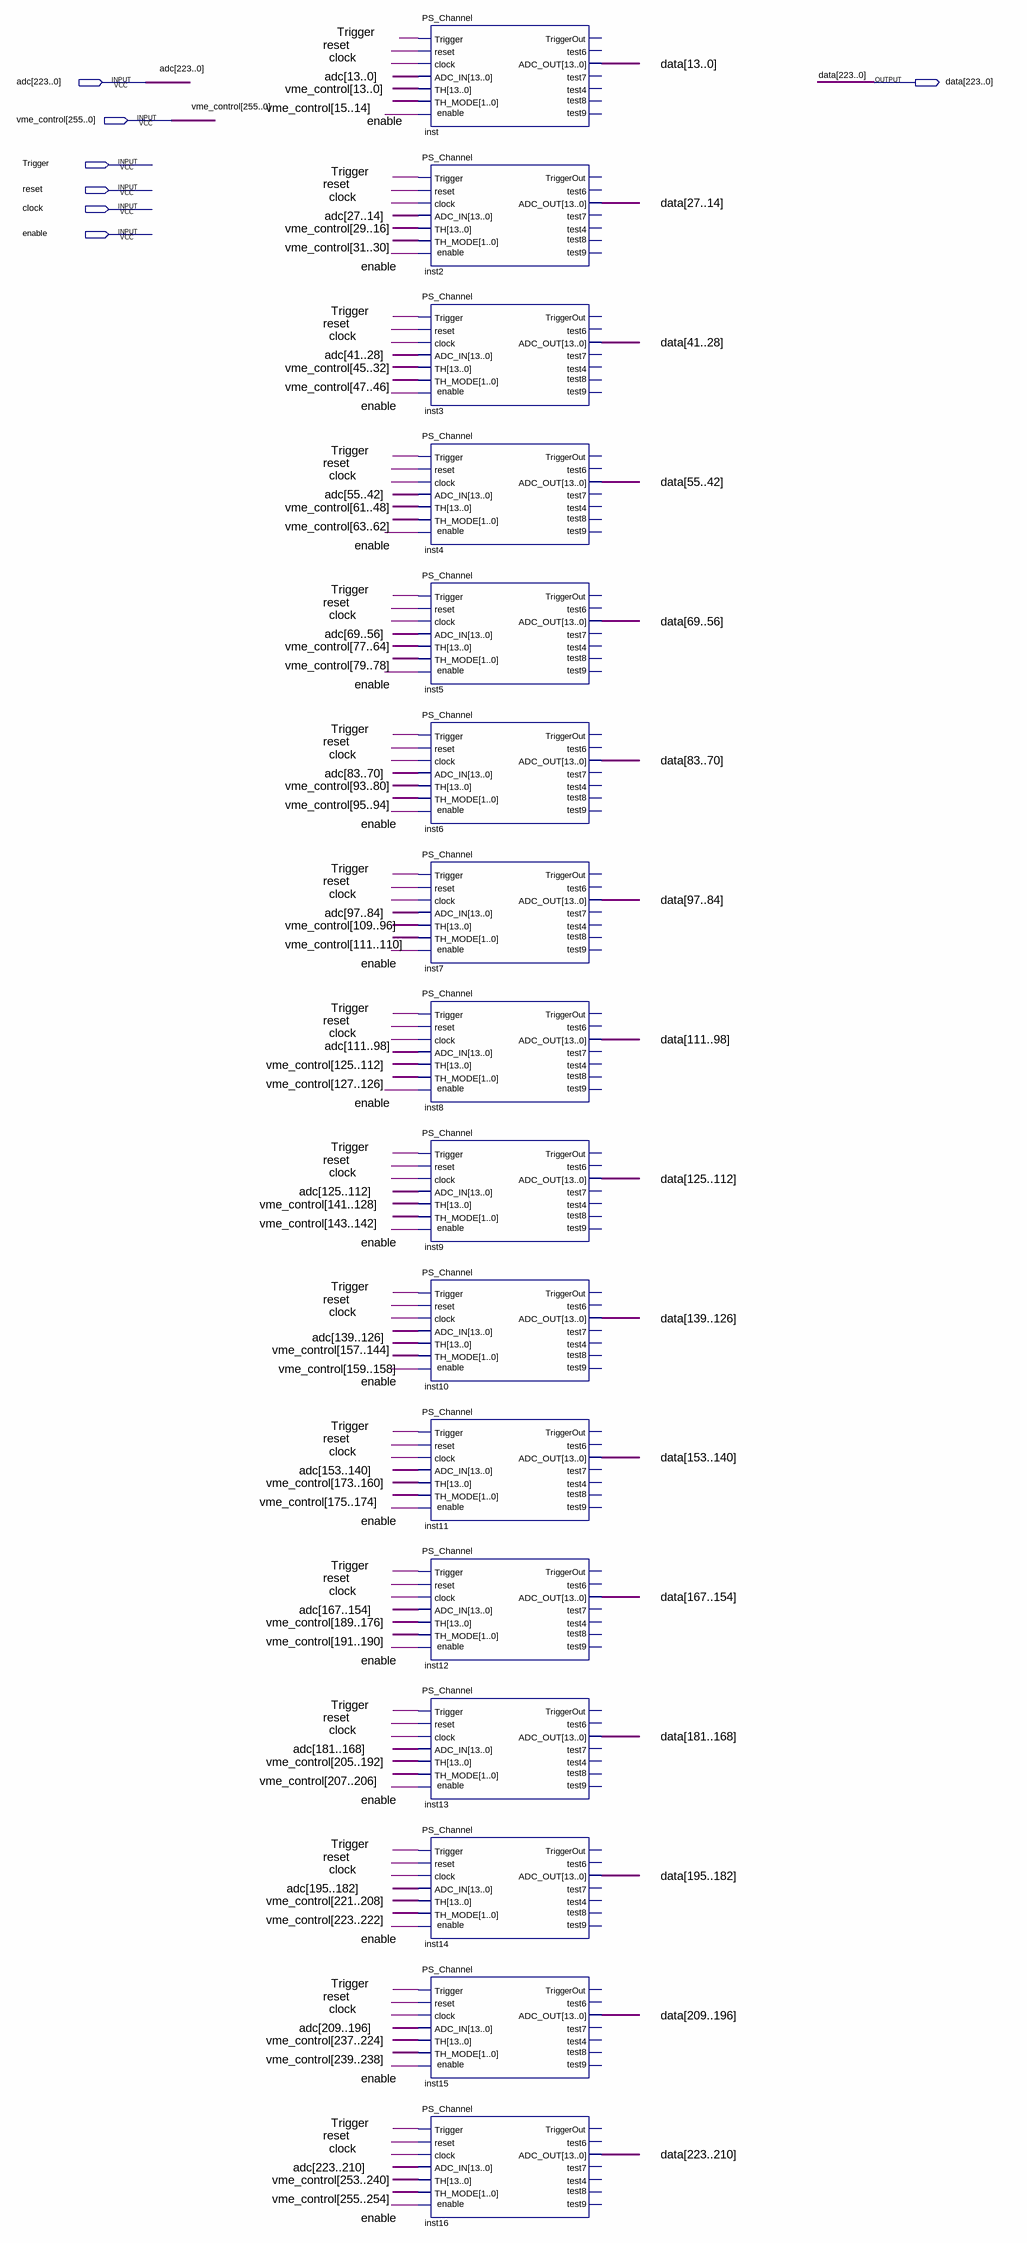
[diagram p0: schematic sheet]
// Quartus schematic PS_Block.bdf as structural Verilog: 16 symbols, 7 pins
module PS_Block (
  input  [223:0] adc,
  input  [255:0] vme_control,
  input  Trigger,
  input  reset,
  input  clock,
  input  enable,
  output [223:0] data
);

  PS_Channel inst (
    .Trigger(Trigger), .reset(reset), .clock(clock), .ADC_IN(adc[13:0]), .TH(vme_control[13:0]),
    .TH_MODE(vme_control[15:14]), .enable(enable), .ADC_OUT(data[13:0]));  // open: TriggerOut, test6, test7, test4, test8, test9
  PS_Channel inst2 (
    .Trigger(Trigger), .reset(reset), .clock(clock), .ADC_IN(adc[27:14]), .TH(vme_control[29:16]),
    .TH_MODE(vme_control[31:30]), .enable(enable), .ADC_OUT(data[27:14]));  // open: TriggerOut, test6, test7, test4, test8, test9
  PS_Channel inst3 (
    .Trigger(Trigger), .reset(reset), .clock(clock), .ADC_IN(adc[41:28]), .TH(vme_control[45:32]),
    .TH_MODE(vme_control[47:46]), .enable(enable), .ADC_OUT(data[41:28]));  // open: TriggerOut, test6, test7, test4, test8, test9
  PS_Channel inst4 (
    .Trigger(Trigger), .reset(reset), .clock(clock), .ADC_IN(adc[55:42]), .TH(vme_control[61:48]),
    .TH_MODE(vme_control[63:62]), .enable(enable), .ADC_OUT(data[55:42]));  // open: TriggerOut, test6, test7, test4, test8, test9
  PS_Channel inst5 (
    .Trigger(Trigger), .reset(reset), .clock(clock), .ADC_IN(adc[69:56]), .TH(vme_control[77:64]),
    .TH_MODE(vme_control[79:78]), .enable(enable), .ADC_OUT(data[69:56]));  // open: TriggerOut, test6, test7, test4, test8, test9
  PS_Channel inst6 (
    .Trigger(Trigger), .reset(reset), .clock(clock), .ADC_IN(adc[83:70]), .TH(vme_control[93:80]),
    .TH_MODE(vme_control[95:94]), .enable(enable), .ADC_OUT(data[83:70]));  // open: TriggerOut, test6, test7, test4, test8, test9
  PS_Channel inst7 (
    .Trigger(Trigger), .reset(reset), .clock(clock), .ADC_IN(adc[97:84]), .TH(vme_control[109:96]),
    .TH_MODE(vme_control[111:110]), .enable(enable), .ADC_OUT(data[97:84]));  // open: TriggerOut, test6, test7, test4, test8, test9
  PS_Channel inst8 (
    .Trigger(Trigger), .reset(reset), .clock(clock), .ADC_IN(adc[111:98]), .TH(vme_control[125:112]),
    .TH_MODE(vme_control[127:126]), .enable(enable), .ADC_OUT(data[111:98]));  // open: TriggerOut, test6, test7, test4, test8, test9
  PS_Channel inst9 (
    .Trigger(Trigger), .reset(reset), .clock(clock), .ADC_IN(adc[125:112]), .TH(vme_control[141:128]),
    .TH_MODE(vme_control[143:142]), .enable(enable), .ADC_OUT(data[125:112]));  // open: TriggerOut, test6, test7, test4, test8, test9
  PS_Channel inst10 (
    .Trigger(Trigger), .reset(reset), .clock(clock), .ADC_IN(adc[139:126]), .TH(vme_control[157:144]),
    .TH_MODE(vme_control[159:158]), .enable(enable), .ADC_OUT(data[139:126]));  // open: TriggerOut, test6, test7, test4, test8, test9
  PS_Channel inst11 (
    .Trigger(Trigger), .reset(reset), .clock(clock), .ADC_IN(adc[153:140]), .TH(vme_control[173:160]),
    .TH_MODE(vme_control[175:174]), .enable(enable), .ADC_OUT(data[153:140]));  // open: TriggerOut, test6, test7, test4, test8, test9
  PS_Channel inst12 (
    .Trigger(Trigger), .reset(reset), .clock(clock), .ADC_IN(adc[167:154]), .TH(vme_control[189:176]),
    .TH_MODE(vme_control[191:190]), .enable(enable), .ADC_OUT(data[167:154]));  // open: TriggerOut, test6, test7, test4, test8, test9
  PS_Channel inst13 (
    .Trigger(Trigger), .reset(reset), .clock(clock), .ADC_IN(adc[181:168]), .TH(vme_control[205:192]),
    .TH_MODE(vme_control[207:206]), .enable(enable), .ADC_OUT(data[181:168]));  // open: TriggerOut, test6, test7, test4, test8, test9
  PS_Channel inst14 (
    .Trigger(Trigger), .reset(reset), .clock(clock), .ADC_IN(adc[195:182]), .TH(vme_control[221:208]),
    .TH_MODE(vme_control[223:222]), .enable(enable), .ADC_OUT(data[195:182]));  // open: TriggerOut, test6, test7, test4, test8, test9
  PS_Channel inst15 (
    .Trigger(Trigger), .reset(reset), .clock(clock), .ADC_IN(adc[209:196]), .TH(vme_control[237:224]),
    .TH_MODE(vme_control[239:238]), .enable(enable), .ADC_OUT(data[209:196]));  // open: TriggerOut, test6, test7, test4, test8, test9
  PS_Channel inst16 (
    .Trigger(Trigger), .reset(reset), .clock(clock), .ADC_IN(adc[223:210]), .TH(vme_control[253:240]),
    .TH_MODE(vme_control[255:254]), .enable(enable), .ADC_OUT(data[223:210]));  // open: TriggerOut, test6, test7, test4, test8, test9
endmodule
